# Altium project dvrk-s-pwm.PrjPCB (part 2 of 2)

## Sheet relay.SchDoc
size Letter; DocumentNumber: 5; SheetNumber: 5; SheetTotal: 6
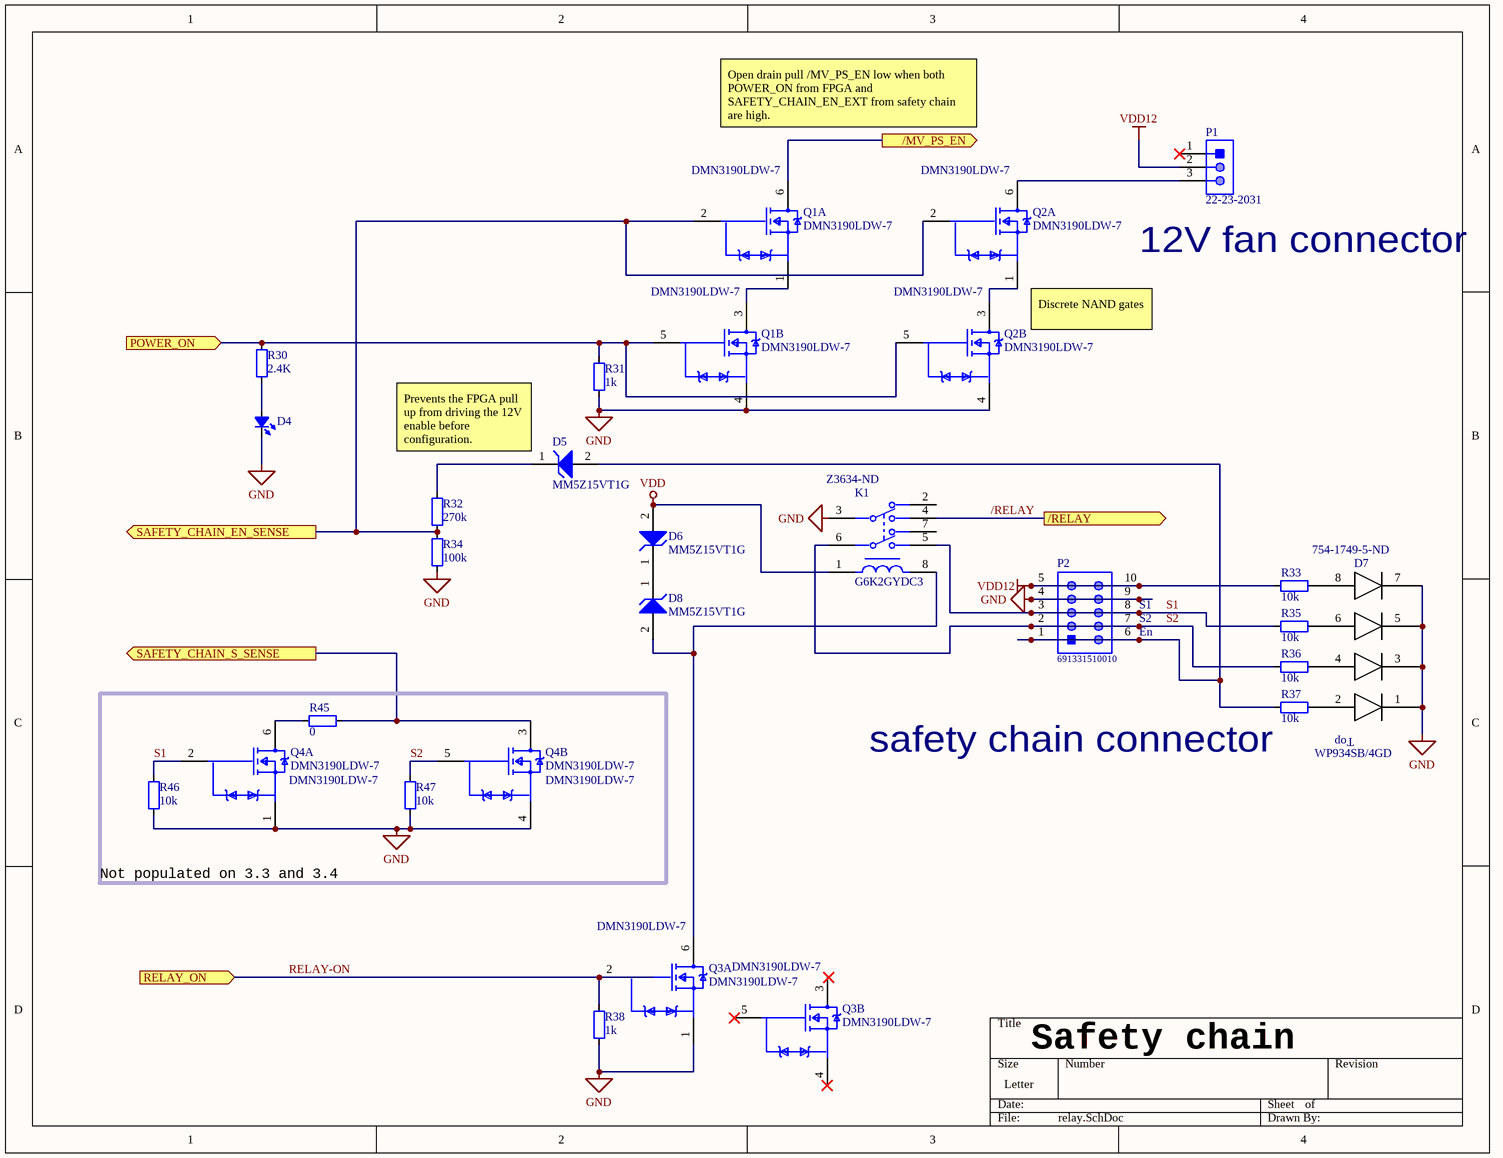
[diagram p4: relay.SchDoc]

### Parts
D4  LED_0402  [ROHM-SML-P11MT_V]  (value not drawn)
D5  MM5Z15VT1G  [ONSC-SOD-523-2-502-01_V]
D6  MM5Z15VT1G  [ONSC-SOD-523-2-502-01_V]
D7  WP934SB/4GD  Supplier Part Number 1: 754-1749-5-ND  [WP934SB/4GD]
D8  MM5Z15VT1G  [ONSC-SOD-523-2-502-01_V]
K1  G6K2GYDC3  Supplier Part Number 1: Z3634-ND  [FP-G6K2GYDC3-MFG]
P1  22-23-2031  [MOLX-22-23-2031_V]
P2  691331510010  [691331510010]
Q1  DMN3190LDW-7  [FP-SOT363-IPC_A]  (parts A,B of 2)
Q2  DMN3190LDW-7  [FP-SOT363-IPC_A]  (parts A,B of 2)
Q3  DMN3190LDW-7  [FP-SOT363-IPC_A]  (parts A,B of 2)
Q4  DMN3190LDW-7  [FP-SOT363-IPC_A]  (parts A,B of 2)
R30  value 2.4K  [FP-CRCW0402-e3-IPC_B]  (hidden comment: Res_0402)
R31  value 1k  [FP-CRCW0805-HPe3-IPC_B]  (hidden comment: Res_0805)
R32  value 270k  [FP-CRCW0402-e3-IPC_B]  (hidden comment: Res_0402)
R33  value 10k  [FP-CRCW0402-e3-IPC_B]  (hidden comment: Res_0402)
R34  value 100k  [FP-CRCW0402-e3-IPC_B]  (hidden comment: Res_0402)
R35  value 10k  [FP-CRCW0402-e3-IPC_B]  (hidden comment: Res_0402)
R36  value 10k  [FP-CRCW0402-e3-IPC_B]  (hidden comment: Res_0402)
R37  value 10k  [FP-CRCW0402-e3-IPC_B]  (hidden comment: Res_0402)
R38  value 1k  [FP-CRCW0805-HPe3-IPC_B]  (hidden comment: Res_0805)
R45  value 0  [FP-CRCW0402-e3-IPC_B]  (hidden comment: Res_0402)
R46  value 10k  [FP-CRCW0402-e3-IPC_B]  (hidden comment: Res_0402)
R47  value 10k  [FP-CRCW0402-e3-IPC_B]  (hidden comment: Res_0402)

### Blocks framed on the sheet
Not populated on 3.3 and 3.4: Q4 R45-R47

### Ports
/MV_PS_EN (out), /RELAY (out), POWER_ON (in), RELAY_ON (in), SAFETY_CHAIN_EN_SENSE (out), SAFETY_CHAIN_S_SENSE (out)

### Nets
GND: D4.2(K) D7.1 D7.3 D7.5 D7.7 K1.3 P2.4 P2.9 Q1.4(S2) Q2.4(S2) Q3.1(S1) Q4.1(S1) Q4.4(S2) R31.1 R34.1 R38.1 R46.1 R47.1
VDD: D6.2(A) K1.1
VDD12: P1.2 P2.5 P2.10 R33.2
/RELAY: K1.4 ; port /RELAY
MOTOR_POWER_EN: Q1.5(G2) Q2.5(G2) R30.2 R31.2 ; port POWER_ON
RELAY-ON: Q3.2(G1) R38.2 ; port RELAY_ON
S1: K1.5 P2.3 P2.8 Q4.2(G1) R35.2 R46.2
S2: K1.6 P2.2 P2.7 Q4.5(G2) R36.2 R47.2
SAFETY_CHAIN_EN_SENSE: Q1.2(G1) Q2.2(G1) R32.1 R34.2 ; port SAFETY_CHAIN_EN_SENSE
SAFETY_CHAIN_S_SENSE: Q4.3(D2) R45.2 ; port SAFETY_CHAIN_S_SENSE
NetD4_1: D4.1(A) R30.1
NetD5_1: D5.1(K) R32.2
NetD5_2: D5.2(A) P2.1 P2.6 R37.2
NetD6_1: D6.1(K) D8.1(K)
NetD7_2: D7.2 R37.1
NetD7_4: D7.4 R36.1
NetD7_6: D7.6 R35.1
NetD7_8: D7.8 R33.1
NetD8_2: D8.2(A) K1.8 Q3.6(D1)
NetJ2_1: Q1.6(D1) ; port /MV_PS_EN
NetP1_3: P1.3 Q2.6(D1)
NetQ1_1: Q1.1(S1) Q1.3(D2)
NetQ2_1: Q2.1(S1) Q2.3(D2)
NetQ4_6: Q4.6(D1) R45.1

Not connected (* = marked no-connect by the designer): K1 2 7; P1 1*; Q3 3(D2) 4(S2)* 5(G2)*

### Notes on the sheet
- Open drain pull /MV_PS_EN low when both POWER_ON from FPGA and SAFETY_CHAIN_EN_EXT from safety chain are high.
- (near P1) 12V fan connector
- (near Q2) Discrete NAND gates
- Prevents the FPGA pull up from driving the 12V enable before configuration.
- (near P2) S1
- (near P2) S2
- (near P2) En
- (near R37) safety chain connector
- Safety chain
- (in symbol WP934SB/4GD) Top

### Library data of the parts
D4 = LED_0402: LED ORANGE CLEAR CHIP SMD; Manufacturer: Kingbright; Manufacturer Part Number: APHHS1005SECK; Viewing Angle: 120°; Lens Style: Clear,Flat; Luminous Intensity: 240mcd; Forward Voltage: 2.1V; Forward Current: 20mA; Dominant Wavelength: 601nm; Number of LEDs: 1; Supplier 1: Digi-Key; Supplier Part Number 1: 754-1103-1-ND; RoHS: Yes; Category: LEDs; Stock 1: 25673; Pricing 1: 1=0.49000, 10=0.32500, 100=0.21700, 500=0.15010, 1000=0.12508 (USD); Mount: Surface Mount; Case/Package: 0402; Number of Pins: 2; Color: Orange; Case Code (Metric): 1005; Case Code (Imperial): 0402; Lens Color: Clear; Min Operating Temperature: -40°C; Max Operating Temperature: 85°C; Package Quantity: 2000; Packaging: Tape and Reel; Illumination Color: Orange; Test Current: 20mA; Wavelength: 601nm; Series: APHHS; Length: 1mm; Width: 0.5mm; Height: 0.6mm; Lead Free: Lead Free; RoHS Compliant: Yes; ComponentLink1URL: https://datasheet.ciiva.com/2114/aphhs1005seck-2114149.pdf?src-supplier=Digi-Key; ComponentLink1Description: https://datasheet.ciiva.com/2114/aphhs1005seck-2114149.pdf?src-supplier=Digi-Key; ComponentLink2URL: https://datasheet.ciiva.com/4688/aphhs1005seck-36485-4688716.pdf?src-supplier=Mouser; ComponentLink2Description: https://datasheet.ciiva.com/4688/aphhs1005seck-36485-4688716.pdf?src-supplier=Mouser; ComponentLink3URL: https://datasheet.ciiva.com/2114/aphhs1005seck-2114150.pdf?src-supplier=Digi-Key; ComponentLink3Description: https://datasheet.ciiva.com/2114/aphhs1005seck-2114150.pdf?src-supplier=Digi-Key; ComponentLink4URL: https://datasheet.ciiva.com/16412/aphhs1005seck-16412186.pdf?src-supplier=Future+Electronics; ComponentLink4Description: https://datasheet.ciiva.com/16412/aphhs1005seck-16412186.pdf?src-supplier=Future+Electronics; ComponentLink5URL: https://datasheet.ciiva.com/2114/aphhs1005seck-2114151.pdf?src-supplier=Digi-Key; ComponentLink5Description: https://datasheet.ciiva.com/2114/aphhs1005seck-2114151.pdf?src-supplier=Digi-Key
D5 D6 D8 = CMP-1060-00793-1: Zener Voltage Regulator, 500 mW, 2-Pin SOD-523, Pb-Free, Tape and Reel; Manufacturer: On Semiconductor; VZ Typ (V): 15; P Max (W): 0.5; PackageVersion: Rev. E, 09/2010; PartNumber: MM5Z15VT1G; ComponentLink2URL: http://www.onsemi.cn/pub_link/Collateral/MM5Z2V4T1-D.PDF; ComponentLink2Description: Datasheet; ComponentLink1Description: Manufacturer URL; PackageReference: SOD-523-2-502-01; ComponentLink3URL: http://www.onsemi.com/pub_link/Collateral/502-01.PDF; PackageDescription: 2-Pin SOD, Body 1.2 x 0.8 mm; ComponentLink3Description: Package Specification; RoHS: Pb-Free; ComponentLink1URL: http://www.onsemi.com/; Mounting Technology: Surface Mount; Packing: Tape and Reel; DatasheetVersion: Rev. 10
D7 = WP934SB/4GD: Triple Green T-1 3mm 40° Green Diffused 30 mcd 2.2 V LED Indicator Through Hole; Manufacturer: Kingbright; Lens Style: Diffused,Tinted; Voltage Rating: 2.2V; Forward Current: 20mA; Wavelength: 568nm; Luminous Intensity: 25mcd; Current: 25mA; Supplier 1: Digi-Key; Manufacturer Part Number: WP934SB/4GD; RoHS: Yes; Category: LEDs; Stock 1: 28787; Pricing 1: 1=1.91000, 10=1.20600, 100=0.89230, 500=0.81992, 1000=0.68250 (USD); Mount: Through Hole; Color: Green; Package Quantity: 600; Packaging: Bulk; Viewing Angle: 40°; Forward Voltage: 2.2V; Illumination Color: Green; Series: -; Lead Free: Lead Free; RoHS Compliant: Yes; ComponentLink1URL: https://datasheet.ciiva.com/26291/wp934sb-4gd-26291283.pdf?src-supplier=Digi-Key; ComponentLink1Description: https://datasheet.ciiva.com/26291/wp934sb-4gd-26291283.pdf?src-supplier=Digi-Key; ComponentLink2URL: https://datasheet.ciiva.com/12414/wp934sb-4gd-13439-12414341.pdf?src-supplier=Mouser; ComponentLink2Description: https://datasheet.ciiva.com/12414/wp934sb-4gd-13439-12414341.pdf?src-supplier=Mouser; ComponentLink3URL: https://datasheet.ciiva.com/2137/wp934sb-4gd-2137244.pdf?src-supplier=Digi-Key; ComponentLink3Description: https://datasheet.ciiva.com/2137/wp934sb-4gd-2137244.pdf?src-supplier=Digi-Key
K1 = CMP-08823-000034-1: RELAY TELECOM DPDT 1A 3VDC; Manufacturer: Omron; Manufacturer Part Number: G6K-2G-Y-DC3; Coil Resistance: 91R; Coil Type: Non-Latching; Max Voltage Rating (DC): 60V; Coil Voltage (DC): 3V; Release Time: 3ms; Coil Current: 33mA; Power Consumption: 100mW; Max Voltage Rating (AC): 125V; Min Operating Temperature: -40°C; Packaging: Rail/Tube; Series: G6K; Contact Material: Gold; Number of Pins: 8; Termination: Gull Wing; Lead Free: Lead Free; Throw Configuration: DPDT; Max Operating Temperature: 70°C; Relay Type: Telecom; Coil Power: 100mW; Contact Current Rating: 1A; Weight: 0.7g; Mount: Surface Mount; Max Current Rating: 1A; Package Quantity: 500; Radiation Hardening: No; Operate Time: 3ms; Supplier 1: Digi-Key; RoHS: Yes; Category: Signal Relays; Stock 1: 11994; Pricing 1: 1=4.45000, 10=4.16900, 25=3.70600, 40=3.52050, 80=3.33525, 230=2.96470, 500=2.77940, 1000=2.59411 (USD); ComponentLink1URL: https://datasheet.ciiva.com/30212/81en-g6k-30212142.pdf?src-supplier=Onlinecomponents.com; ComponentLink1Description: https://datasheet.ciiva.com/30212/81en-g6k-30212142.pdf?src-supplier=Onlinecomponents.com
P1 = CMP-2000-05242-1: Male Header, Pitch 2.54 mm, 1 x 3 Position, Height 8.18 mm, Tail Length 3.56 mm, RoHS, Bulk; Current Rating: 4A; Brand: Molex; Pitch: 2.54mm; Voltage Rating: 250V; Mounting Angle: Vertical; Type: Locking; Factory Pack Quantity: 16000; Tradename: KK; Housing Material: Nylon; Contact Material: Brass; Manufacturer URL: http://www.molex.com/; Termination Style: ThroughHole; Mounting Style: ThroughHole; Number of Positions: 3Position; Contact Gender: Pin(Male); Packaging: Bulk; Series: 6373; Datasheet Version: Sep-01; Contact Plating: Tin; Product: Headers; Datasheet URL: https://datasheet.ciiva.com/19472/232274-19472863.pdf; RoHS: Details; Product Category: Headers&WireHousings; Manufacturer: Molex; Number of Rows: 1Row
P2 = CMP-1502-02269-1: Serie 3315 - 5.08mm Double Level Horizontal Male PCB Header with Flanges WR-TBL, 10 pin; Manufacturer: Wurth Elektronik; Pin Number: 10; Datasheet URL: http://katalog.we-online.de/em/datasheet/6913315100xx.pdf; Part Number: 691331510010; Gender: Male; Manufacturer URL: http://www.we-online.de; Packaging: Box; Pitch: 5.08mm; Operating Temperature: -40to105degC; Publisher: WurthElektronik; Mounting Technology: THT; Package Reference: 691331510010
Q1-Q4 = CMP-12801-000100-1: MOSFET 2N-CH 30V 1A SOT363; Turn-Off Delay Time: 30.3ns; Turn-On Delay Time: 4.5ns; Number of Channels: 2; Max Power Dissipation: 320mW; Input Capacitance: 87pF; Rds On Max: 190mR; FET Type: 2 N-Channel; Gate to Source Voltage (Vgs): 20V; Rise Time: 8.9ns; Element Configuration: Dual; Fall Time: 15.6ns; Number of Pins: 6; Width: 1.35mm; Package Quantity: 3000; Drain to Source Voltage (Vdss): 30V; Length: 2.2mm; Case/Package: SOT-363; Weight: 0.000212oz; Min Operating Temperature: -55°C; Lead Free: Lead Free; Height: 1mm; Radiation Hardening: No; Drain to Source Resistance: 190mR; Continuous Drain Current (ID): 1A; Mount: Surface Mount; Packaging: Tape and Reel; Max Operating Temperature: 150°C; Supplier 1: Arrow Electronics; Supplier Part Number 1: DMN3190LDW-7
R30 R32-R37 R45-R47 = Res_0402: Resistor
R31 R38 = Res_0805: Resistor

## Sheet motor_channel_x2.SchDoc
size A3; DocumentNumber: 2; SheetNumber: 2; SheetTotal: 6
Used 5 times, as channels Ch1, Ch2, Ch3, Ch4, Ch5. Parts and nets are listed once, with the designators drawn on the sheet.
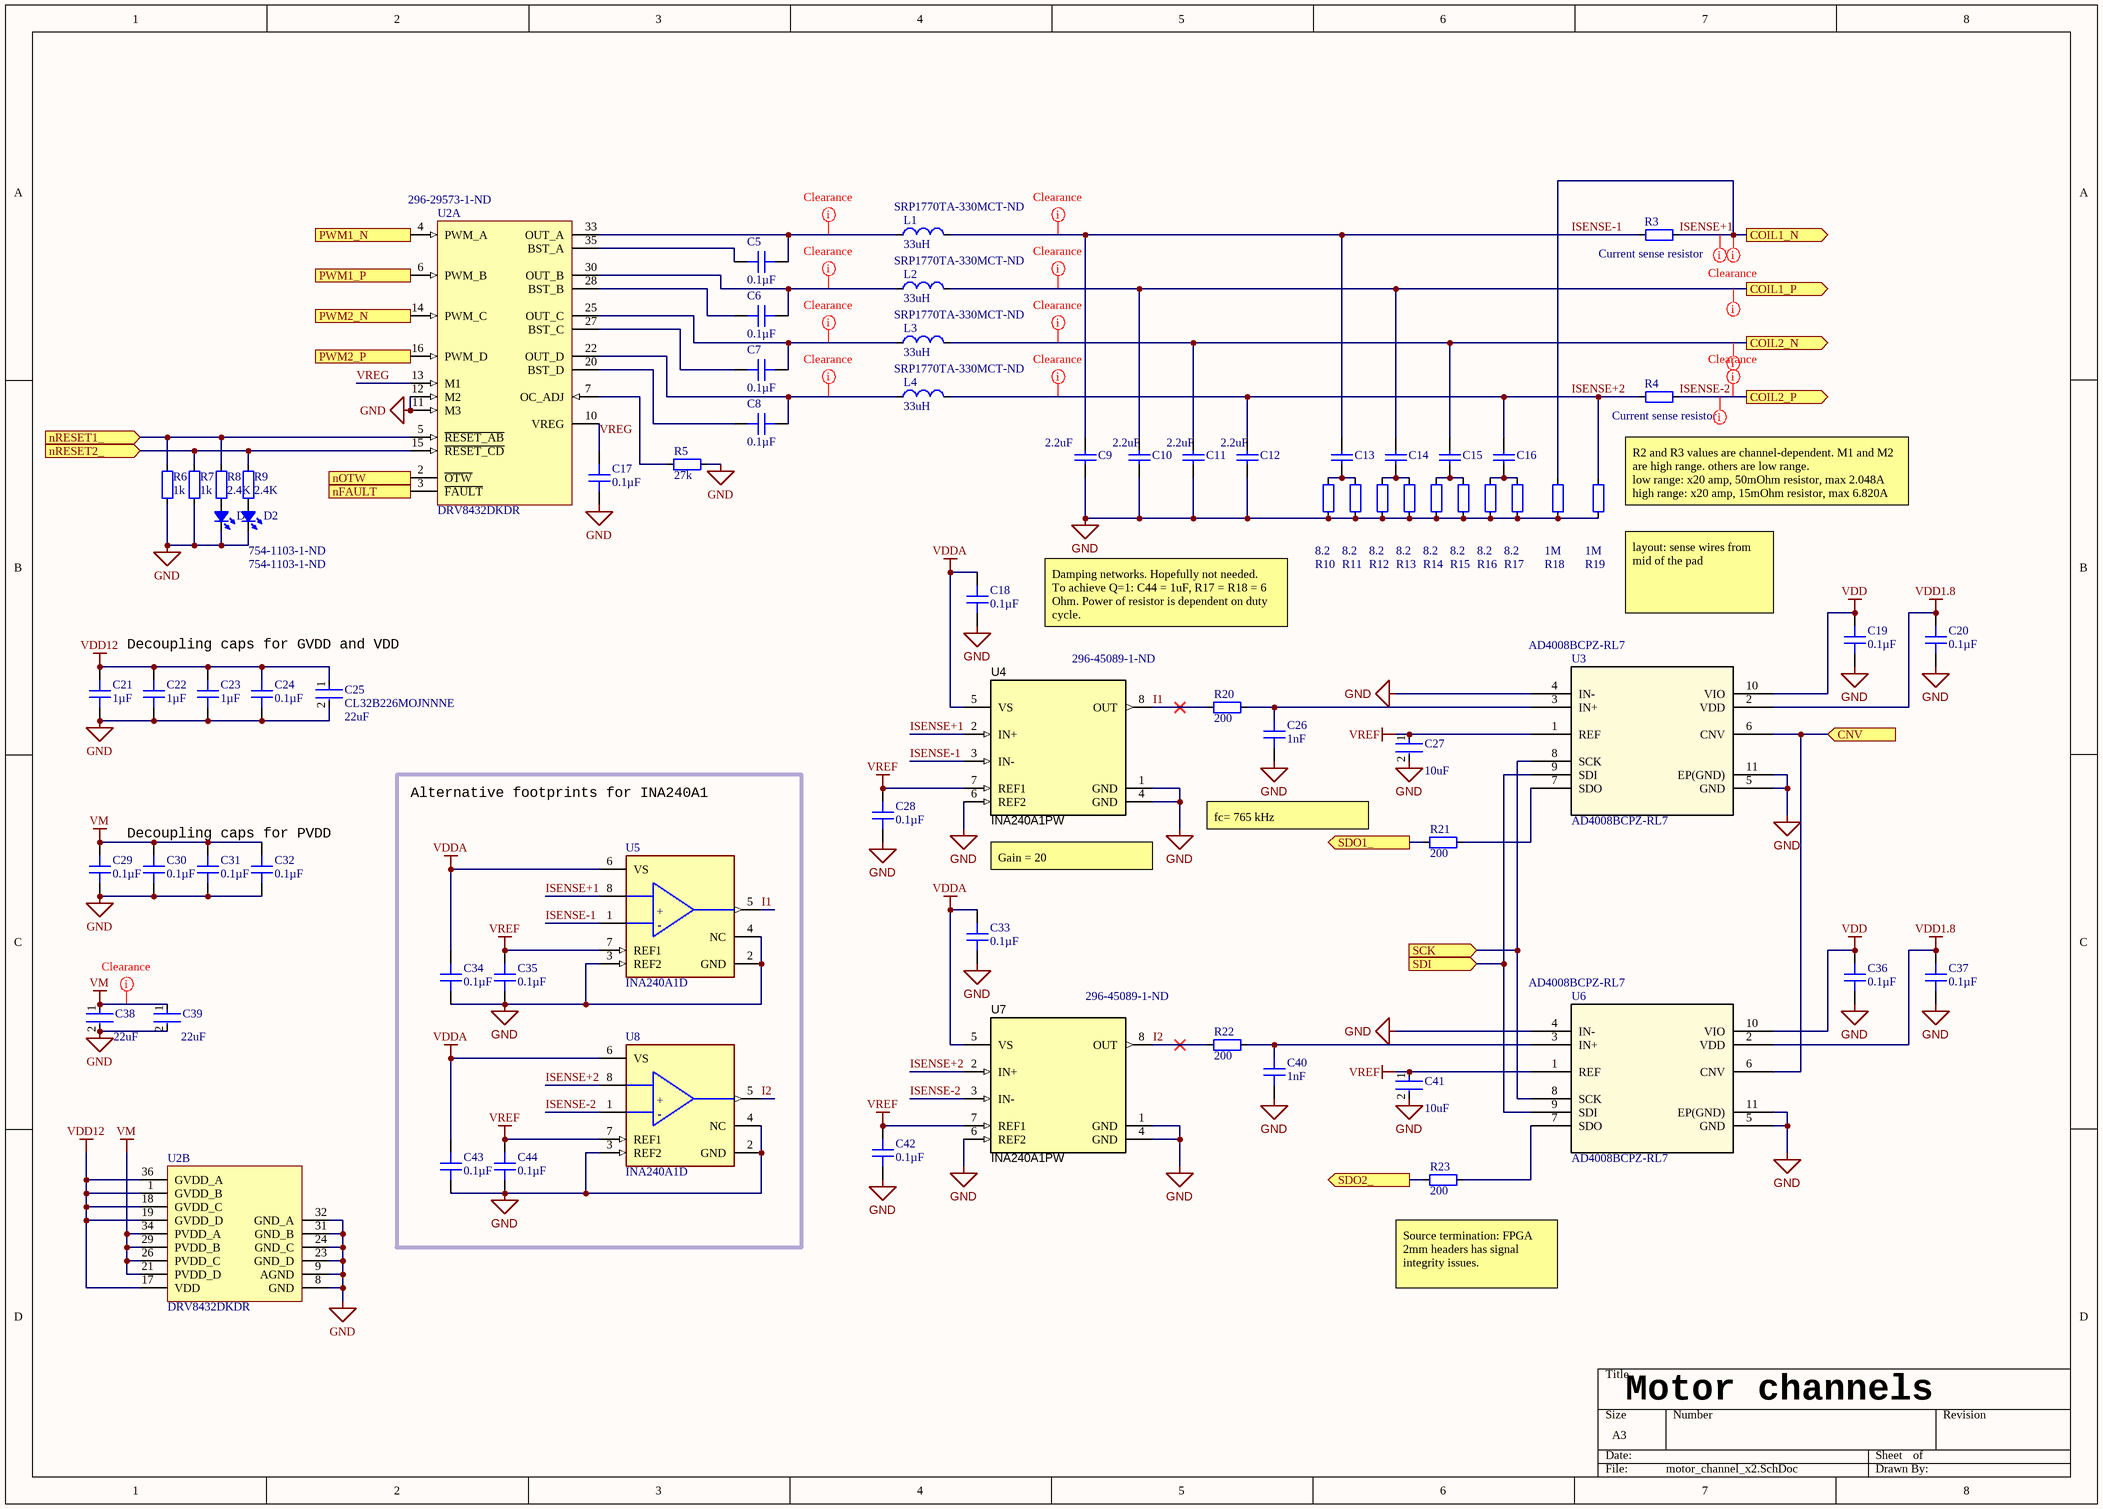
[diagram p5: motor_channel_x2.SchDoc]

### Parts
C5  0.1µF  [FP-GRM188-0_1-e0_2_0_55-IPC_B]
C6  0.1µF  [FP-GRM188-0_1-e0_2_0_55-IPC_B]
C7  0.1µF  [FP-GRM188-0_1-e0_2_0_55-IPC_B]
C8  0.1µF  [FP-GRM188-0_1-e0_2_0_55-IPC_B]
C9  Capacitance: 2.2uF  [CAPC3216X180X50NL20T25]  (hidden comment: 12061C225KAT2A)
C10  Capacitance: 2.2uF  [CAPC3216X180X50NL20T25]  (hidden comment: 12061C225KAT2A)
C11  Capacitance: 2.2uF  [CAPC3216X180X50NL20T25]  (hidden comment: 12061C225KAT2A)
C12  Capacitance: 2.2uF  [CAPC3216X180X50NL20T25]  (hidden comment: 12061C225KAT2A)
C13  12061C105KAT2A  [CAPC3216X180X50NL20T25]  (value not drawn)
C14  12061C105KAT2A  [CAPC3216X180X50NL20T25]  (value not drawn)
C15  12061C105KAT2A  [CAPC3216X180X50NL20T25]  (value not drawn)
C16  12061C105KAT2A  [CAPC3216X180X50NL20T25]  (value not drawn)
C17  0.1µF  [FP-GRM155-0_05-IPC_B]
C18  0.1µF  [FP-GRM155-0_05-IPC_B]
C19  0.1µF  [FP-GRM155-0_05-IPC_B]
C20  0.1µF  [FP-GRM155-0_05-IPC_B]
C21  1µF  [FP-GRM188-0_1-e0_2_0_55-IPC_B]
C22  1µF  [FP-GRM188-0_1-e0_2_0_55-IPC_B]
C23  1µF  [FP-GRM188-0_1-e0_2_0_55-IPC_B]
C24  0.1µF  [FP-GRM155-0_05-IPC_B]
C25  CL32B226MOJNNNE  Capacitance: 22uF  [FP-CL32-IPC_B]
C26  1nF  [FP-GRM155-0_05-IPC_B]
C27  Capacitance: 10uF  [FP-CL21-IPC_C]  (hidden comment: CL21B106KQQNNNG)
C28  0.1µF  [FP-GRM155-0_05-IPC_B]
C29  0.1µF  [FP-GRM188-0_1-e0_2_0_55-IPC_B]
C30  0.1µF  [FP-GRM188-0_1-e0_2_0_55-IPC_B]
C31  0.1µF  [FP-GRM188-0_1-e0_2_0_55-IPC_B]
C32  0.1µF  [FP-GRM188-0_1-e0_2_0_55-IPC_B]
C33  0.1µF  [FP-GRM155-0_05-IPC_B]
C34  0.1µF  [FP-GRM155-0_05-IPC_B]
C35  0.1µF  [FP-GRM155-0_05-IPC_B]
C36  0.1µF  [FP-GRM155-0_05-IPC_B]
C37  0.1µF  [FP-GRM155-0_05-IPC_B]
C38  Capacitance: 22uF  [FP-KRM55W-6_1_5_3_6_7_1_2-MFG]  (hidden comment: KRM55WR72A226MH01L)
C39  Capacitance: 22uF  [FP-KRM55W-6_1_5_3_6_7_1_2-MFG]  (hidden comment: KRM55WR72A226MH01L)
C40  1nF  [FP-GRM155-0_05-IPC_B]
C41  Capacitance: 10uF  [FP-CL21-IPC_C]  (hidden comment: CL21B106KQQNNNG)
C42  0.1µF  [FP-GRM155-0_05-IPC_B]
C43  0.1µF  [FP-GRM155-0_05-IPC_B]
C44  0.1µF  [FP-GRM155-0_05-IPC_B]
D1  Supplier Part Number 1: 754-1103-1-ND  [ROHM-SML-P11MT_V]  (hidden comment: LED_0402)
D2  Supplier Part Number 1: 754-1103-1-ND  [ROHM-SML-P11MT_V]  (hidden comment: LED_0402)
L1  value 33uH  Supplier Part Number 1: SRP1770TA-330MCT-ND  [SRP1770TA]
L2  value 33uH  Supplier Part Number 1: SRP1770TA-330MCT-ND  [SRP1770TA]
L3  value 33uH  Supplier Part Number 1: SRP1770TA-330MCT-ND  [SRP1770TA]
L4  value 33uH  Supplier Part Number 1: SRP1770TA-330MCT-ND  [SRP1770TA]
R3  Current sense resistor  [STACKPOLE CSR2512]
R4  Current sense resistor  [STACKPOLE CSR2512]
R5  value 27k  [FP-CRCW0402-e3-IPC_B]  (hidden comment: Res_0402)
R6  value 1k  [FP-CRCW0805-HPe3-IPC_B]  (hidden comment: Res_0805)
R7  value 1k  [FP-CRCW0805-HPe3-IPC_B]  (hidden comment: Res_0805)
R8  value 2.4K  [FP-CRCW0402-e3-IPC_B]  (hidden comment: Res_0402)
R9  value 2.4K  [FP-CRCW0402-e3-IPC_B]  (hidden comment: Res_0402)
R10  value 8.2  [RESC3216X70X50NL05T20]  (hidden comment: Res_0402)
R11  value 8.2  [RESC3216X70X50NL05T20]  (hidden comment: Res_0402)
R12  value 8.2  [RESC3216X70X50NL05T20]  (hidden comment: Res_0402)
R13  value 8.2  [RESC3216X70X50NL05T20]  (hidden comment: Res_0402)
R14  value 8.2  [RESC3216X70X50NL05T20]  (hidden comment: Res_0402)
R15  value 8.2  [RESC3216X70X50NL05T20]  (hidden comment: Res_0402)
R16  value 8.2  [RESC3216X70X50NL05T20]  (hidden comment: Res_0402)
R17  value 8.2  [RESC3216X70X50NL05T20]  (hidden comment: Res_0402)
R18  value 1M  [FP-CRCW0402-e3-IPC_B]  (hidden comment: Res_0402)
R19  value 1M  [FP-CRCW0402-e3-IPC_B]  (hidden comment: Res_0402)
R20  value 200  [FP-CRCW0402-e3-IPC_B]  (hidden comment: Res_0402)
R21  value 200  [FP-CRCW0402-e3-IPC_B]  (hidden comment: Res_0402)
R22  value 200  [FP-CRCW0402-e3-IPC_B]  (hidden comment: Res_0402)
R23  value 200  [FP-CRCW0402-e3-IPC_B]  (hidden comment: Res_0402)
U2  DRV8432DKDR  Supplier Part Number 1: 296-29573-1-ND  [DKD0036A_L_extra_clearance]  (parts A,B of 2)
U3  AD4008BCPZ-RL7  [CP_10_9]
U4  INA240A1PW  Supplier Part Number 1: 296-45089-1-ND  [PW0008A_N]
U5  INA240A1D  [FP-D0008A-IPC_C]
U6  AD4008BCPZ-RL7  [CP_10_9]
U7  INA240A1PW  Supplier Part Number 1: 296-45089-1-ND  [PW0008A_N]
U8  INA240A1D  [FP-D0008A-IPC_C]

### Blocks framed on the sheet
Alternative footprints for INA240A1: C34 C35 C43 C44 U5 U8

### Ports
CNV (in), COIL1_N (out), COIL1_P (out), COIL2_N (out), COIL2_P (out), nFAULT (out), nOTW (out), nRESET1_ (in), nRESET2_ (in), PWM1_N (in), PWM1_P (in), PWM2_N (in), PWM2_P (in), SCK (in), SDI (in), SDO1_ (out), SDO2_ (out)

### Nets
GND: C9.1 C10.1 C11.1 C12.1 C17.2 C18.2 C19.2 C20.2 C21.2 C22.2 C23.2 C24.2 C25.2 C26.2 C27.2 C28.2 C29.2 C30.2 C31.2 C32.2 C33.2 C34.2 C35.2 C36.2 C37.2 C38.2 C39.2 C40.2 C41.2 C42.2 C43.2 C44.2 D1.2(K) D2.2(K) R5.2 R6.1 R7.1 R10.1 R11.1 R12.1 R13.1 R14.1 R15.1 R16.1 R17.1 R18.1 R19.1 U2.8(GND) U2.9(AGND) U2.11(M3) U2.12(M2) U2.23(GND_D) U2.24(GND_C) U2.31(GND_B) U2.32(GND_A) U3.4(IN-) U3.5(GND) U3.11(EP(GND)) U4.1(GND) U4.4(GND) U4.6(REF2) U5.2(GND) U5.3(REF2) U5.4(NC) U6.4(IN-) U6.5(GND) U6.11(EP(GND)) U7.1(GND) U7.4(GND) U7.6(REF2) U8.2(GND) U8.3(REF2) U8.4(NC)
VDD: C19.1 C36.1 U3.10(VIO) U6.10(VIO)
VDD1.8: C20.1 C37.1 U3.2(VDD) U6.2(VDD)
VDD12: C21.1 C22.1 C23.1 C24.1 C25.1 U2.1(GVDD_B) U2.17(VDD) U2.18(GVDD_C) U2.19(GVDD_D) U2.36(GVDD_A)
VDDA: C18.1 C33.1 C34.1 C43.1 U4.5(VS) U5.6(VS) U7.5(VS) U8.6(VS)
VM: C29.1 C30.1 C31.1 C32.1 C38.1 C39.1 U2.21(PVDD_D) U2.26(PVDD_C) U2.29(PVDD_B) U2.34(PVDD_A)
VREF: C27.1 C28.1 C35.1 C41.1 C42.1 C44.1 U3.1(REF) U4.7(REF1) U5.7(REF1) U6.1(REF) U7.7(REF1) U8.7(REF1)
CNV: U3.6(CNV) U6.6(CNV) ; port CNV
COIL1_P: C10.2 C14.1 L2.2 ; port COIL1_P
COIL2_N: C11.2 C15.1 L3.2 ; port COIL2_N
I1: R20.1 U4.8(OUT) U5.5(OUT)
I2: R22.1 U7.8(OUT) U8.5(OUT)
ISENSE+1: R3.2 R18.2 U4.2(IN+) U5.8(IN+) ; port COIL1_N
ISENSE+2: C12.2 C16.1 L4.2 R4.1 R19.2 U7.2(IN+) U8.8(IN+)
ISENSE-1: C9.2 C13.1 L1.2 R3.1 U4.3(IN-) U5.1(IN-)
ISENSE-2: R4.2 U7.3(IN-) U8.1(IN-) ; port COIL2_P
nFAULT: U2.3(~{FAULT}) ; port nFAULT
nOTW: U2.2(~{OTW}) ; port nOTW
nRESET1_: R6.2 R8.2 U2.5(~{RESET_AB}) ; port nRESET1_
nRESET2_: R7.2 R9.2 U2.15(~{RESET_CD}) ; port nRESET2_
PWM1_N: U2.4(PWM_A) ; port PWM1_N
PWM1_P: U2.6(PWM_B) ; port PWM1_P
PWM2_N: U2.14(PWM_C) ; port PWM2_N
PWM2_P: U2.16(PWM_D) ; port PWM2_P
SCK: U3.8(SCK) U6.8(SCK) ; port SCK
SDI: U3.9(SDI) U6.9(SDI) ; port SDI
SDO1_: R21.1 ; port SDO1_
SDO2_: R23.1 ; port SDO2_
VREG: C17.1 U2.10(VREG) U2.13(M1)
NetC5_1: C5.1 U2.35(BST_A)
NetC5_2: C5.2 L1.1 U2.33(OUT_A)
NetC6_1: C6.1 U2.28(BST_B)
NetC6_2: C6.2 L2.1 U2.30(OUT_B)
NetC7_1: C7.1 U2.27(BST_C)
NetC7_2: C7.2 L3.1 U2.25(OUT_C)
NetC8_1: C8.1 U2.20(BST_D)
NetC8_2: C8.2 L4.1 U2.22(OUT_D)
NetC13_2: C13.2 R10.2 R11.2
NetC14_2: C14.2 R12.2 R13.2
NetC15_2: C15.2 R14.2 R15.2
NetC16_2: C16.2 R16.2 R17.2
NetC26_1: C26.1 R20.2 U3.3(IN+)
NetC40_1: C40.1 R22.2 U6.3(IN+)
NetD1_1: D1.1(A) R8.1
NetD2_1: D2.1(A) R9.1
NetR5_1: R5.1 U2.7(OC_ADJ)
NetR21_2: R21.2 U3.7(SDO)
NetR23_2: R23.2 U6.7(SDO)

### Channels
Ch1: designators end in _Ch1; ports CNV=ADC_CNV COIL1_N=BRAKE2 COIL1_P=/BRAKE2 COIL2_N=BRAKE1 COIL2_P=/BRAKE1 nFAULT=nFAULT1 nOTW=nOTW1 nRESET1_=nRESET1_1 nRESET2_=nRESET2_1 PWM1_N=PWM1_N1 PWM1_P=PWM1_P1 PWM2_N=PWM2_N1 PWM2_P=PWM2_P1 SCK=ADC_SCK SDI=ADC_SDI SDO1_=ADC_CUR_SDO1_1 SDO2_=ADC_CUR_SDO2_1
Ch2: designators end in _Ch2; ports CNV=ADC_CNV COIL1_N=COIL1_N2 COIL1_P=/MOTOR1 COIL2_N=BRAKE3 COIL2_P=/BRAKE3 nFAULT=nFAULT2 nOTW=nOTW2 nRESET1_=nRESET1_2 nRESET2_=nRESET2_2 PWM1_N=PWM1_N2 PWM1_P=PWM1_P2 PWM2_N=PWM2_N2 PWM2_P=PWM2_P2 SCK=ADC_SCK SDI=ADC_SDI SDO1_=ADC_CUR_SDO1_2 SDO2_=ADC_CUR_SDO2_2
Ch3: designators end in _Ch3; ports CNV=ADC_CNV COIL1_N=COIL1_N3 COIL1_P=/MOTOR2 COIL2_N=COIL2_N3 COIL2_P=/MOTOR5 nFAULT=nFAULT3 nOTW=nOTW3 nRESET1_=nRESET1_3 nRESET2_=nRESET2_3 PWM1_N=PWM1_N3 PWM1_P=PWM1_P3 PWM2_N=PWM2_N3 PWM2_P=PWM2_P3 SCK=ADC_SCK SDI=ADC_SDI SDO1_=ADC_CUR_SDO1_3 SDO2_=ADC_CUR_SDO2_3
Ch4: designators end in _Ch4; ports CNV=ADC_CNV COIL1_N=COIL1_N4 COIL1_P=/MOTOR3 COIL2_N=COIL2_N4 COIL2_P=/MOTOR6 nFAULT=nFAULT4 nOTW=nOTW4 nRESET1_=nRESET1_4 nRESET2_=nRESET2_4 PWM1_N=PWM1_N4 PWM1_P=PWM1_P4 PWM2_N=PWM2_N4 PWM2_P=PWM2_P4 SCK=ADC_SCK SDI=ADC_SDI SDO1_=ADC_CUR_SDO1_4 SDO2_=ADC_CUR_SDO2_4
Ch5: designators end in _Ch5; ports CNV=ADC_CNV COIL1_N=COIL1_N5 COIL1_P=/MOTOR4 COIL2_N=COIL2_N5 COIL2_P=/MOTOR7 nFAULT=nFAULT5 nOTW=nOTW5 nRESET1_=nRESET1_5 nRESET2_=nRESET2_5 PWM1_N=PWM1_N5 PWM1_P=PWM1_P5 PWM2_N=PWM2_N5 PWM2_P=PWM2_P5 SCK=ADC_SCK SDI=ADC_SDI SDO1_=ADC_CUR_SDO1_5 SDO2_=ADC_CUR_SDO2_5

### Layout directives
net class hv: /BRAKE1, /BRAKE2, BRAKE1, BRAKE2, ISENSE+2_Ch1, ISENSE-1_Ch1, NetC5_Ch1_2, NetC6_Ch1_2, NetC7_Ch1_2, NetC8_Ch1_2, VM
net class no-copy-routing: /BRAKE1, /BRAKE2, BRAKE1, BRAKE2

### Notes on the sheet
- R2 and R3 values are channel-dependent. M1 and M2 are high range. others are low range.
  low range: x20 amp, 50mOhm resistor, max 2.048A
  high range: x20 amp, 15mOhm resistor, max 6.820A
- Decoupling caps for GVDD and VDD
- Damping networks. Hopefully not needed.
  To achieve Q=1: C44 = 1uF, R17 = R18 = 6 Ohm. Power of resistor is dependent on duty cycle.
- (near R19) layout: sense wires from mid of the pad
- Decoupling caps for PVDD
- fc= 765 kHz
- Gain = 20
- (near R23) Source termination: FPGA 2mm headers has signal integrity issues.
- Motor channels
- (in symbol CMP-04895-000409-1) +; -

### Library data of the parts
C5-C8 C29-C32 = 06031C104KAT2A: CAP CER 0.1UF 100V X7R 0603; Manufacturer: AVX Corporation; Tolerance: ±10%; Part Number: 06031C104KAT2A; Value: 0.1µF; Applications: General Purpose; Capacitance: 0.1µF; ComponentLink1Description: Datasheet; ComponentLink1URL: http://datasheets.avx.com/X7RDielectric.pdf; ComponentLink2Description: DigiKey Link; ComponentLink2URL: http://digikey.com/product-detail/en/avx-corporation/06031C104KAT2A/478-10047-1-ND/6564270; Device Package: 0603 (1608 Metric); LastUpdated: 9/2/2020 1:03:14 AM; Lifecycle Status: Active; Minimum Order: 1; Mounting Type: Surface Mount, MLCC; Operating Temperature: -55°C ~ 125°C; Package / Case: 0603 (1608 Metric); Packaging: TapeAndReel; PartId: 14077; Part Status: Active; Price: 0.03; Series: -; Size / Dimension: 0.063" L x 0.032" W (1.60mm x 0.81mm); Supplier 1: DigiKey; Supplier Part Number 1: 478-10047-1-ND; Temperature Coefficient: X7R; Thickness (Max): 0.037" (0.94mm); Voltage - Rated: 100V
C9-C12 = CMP-2000-07542-1: Chip Capacitor, 2.2 uF, +/- 10%, 100 V, -55 to 125 degC, 1206 (3216 Metric), RoHS, Tape and Reel; Manufacturer: AVX; Case\/Package: 1206; Voltage: 100V; Dielectric: X7R; Thickness: 0.037inch; Case Code (Metric): 3216; Mounting Technology: SurfaceMount; Tolerance: 10%; Package Quantity: 2500; Mount: SurfaceMount; REACH SVHC: NoSVHC; Case Code (Imperial): 1206; Datasheet URL: http://datasheets.avx.com/X7RDielectric.pdf; Voltage Rating: 100V; Package Reference: 1206; Termination: SMD/SMT; Max Operating Temperature: 125degC; Depth: 1.6mm; Voltage Rating (DC): 100V; Width: 0.063inch; Min Operating Temperature: -55degC; RoHSCompliant: true; Packaging: TapeandReel; Package Description: 2-Pin Surface Mount Device, Body 3.2 x 1.6 mm; Datasheet Version: 03/2017; Manufacturer URL: http://www.avx.com/; Lead Free: LeadFree; Length: 3.2mm
C13-C16 = CMP-1037-04728-2: Chip Capacitor, 1 uF, +/- 10%, 100 V, -55 to 125 degC, 1206 (3216 Metric), RoHS, Tape and Reel; Manufacturer: AVX; Capacitance: 1µF; Dielectric: X7R; Rated Voltage: 100V; Mounting Technology: SurfaceMount; Package Description: 2-Pin Surface Mount Device, Body 3.2 x 1.6 mm; Case Size/Dimension: 1206; Datasheet Version: 07/2016; Manufacturer URL: http://www.avx.com/; Package Reference: 1206; Datasheet URL: http://datasheets.avx.com/X7RDielectric.pdf; Tolerance (%): ±10%
C17-C20 C24 C28 C33-C37 C42-C44 = 04023C104KAT2A: CAP CER 0.1UF 25V X7R 0402; Manufacturer: AVX Corporation; Tolerance: ±10%; Value: 0.1µF; Part Number: 04023C104KAT2A; Applications: General Purpose; Capacitance: 0.1µF; ComponentLink1Description: Datasheet; ComponentLink1URL: http://datasheets.avx.com/X7RDielectric.pdf; ComponentLink2Description: DigiKey Link; ComponentLink2URL: http://digikey.com/product-detail/en/avx-corporation/04023C104KAT2A/478-7868-1-ND/3881491; Device Package: 0402 (1005 Metric); LastUpdated: 9/2/2020 1:02:21 AM; Lifecycle Status: Active; Minimum Order: 1; Mounting Type: Surface Mount, MLCC; Operating Temperature: -55°C ~ 125°C; Package / Case: 0402 (1005 Metric); Packaging: CutTape; PartId: 3190; Part Status: Active; Price: 0.13; Series: -; Size / Dimension: 0.039" L x 0.020" W (1.00mm x 0.50mm); Supplier 1: DigiKey; Supplier Part Number 1: 478-7868-1-ND; Temperature Coefficient: X7R; Thickness (Max): 0.022" (0.55mm); Voltage - Rated: 25V
C21-C23 = TMK107B7105KA-T: CAP CER 1UF 25V X7R 0603; Manufacturer: Taiyo Yuden; Tolerance: ±10%; Part Number: TMK107B7105KA-T; Value: 1µF; Applications: General Purpose; Capacitance: 1µF; ComponentLink1Description: Datasheet; ComponentLink1URL: https://www.yuden.co.jp/productdata/catalog/mlcc01_e.pdf; ComponentLink2Description: DigiKey Link; ComponentLink2URL: http://digikey.com/product-detail/en/taiyo-yuden/TMK107B7105KA-T/587-2984-1-ND/2714177; Device Package: 0603 (1608 Metric); LastUpdated: 9/2/2020 1:03:30 AM; Lifecycle Status: Active; Minimum Order: 1; Mounting Type: Surface Mount, MLCC; Operating Temperature: -55°C ~ 125°C; Package / Case: 0603 (1608 Metric); Packaging: TapeAndReel; PartId: 5586; Part Status: Active; Price: 0.01; Series: M; Size / Dimension: 0.063" L x 0.031" W (1.60mm x 0.80mm); Supplier 1: DigiKey; Supplier Part Number 1: 587-2984-1-ND; Temperature Coefficient: X7R; Thickness (Max): 0.035" (0.90mm); Voltage - Rated: 25V
C25 = CMP-13271-003818-1: Cap Ceramic 22uF 16V X7R ±20% SMD 1210 +125°C Embossed T/R; Mount: Surface Mount; Case/Package: 1210; Case Code (Imperial): 1210; Depth: 2.5mm; Packaging: Tape and Reel; Case Code (Metric): 3225; Package Quantity: 1; Min Operating Temperature: -55°C; Dielectric: X7R; Height: 2.5mm; Length: 3.2mm; Max Operating Temperature: 125°C; Thickness: 0.106inch; Width: 0.098inch; Tolerance: 20%; Voltage Rating: 16V; Radiation Hardening: No
C26 C40 = 04023C102KAT2A: CAP CER 1000PF 25V X7R 0402; Manufacturer: AVX Corporation; Tolerance: ±10%; Value: 1nF; ComponentLink1Description: Datasheet; ComponentLink1URL: http://datasheets.avx.com/X7RDielectric.pdf; Part Number: 04023C102KAT2A; Applications: General Purpose; Capacitance: 1000pF; ComponentLink2Description: DigiKey Link; ComponentLink2URL: http://digikey.com/product-detail/en/avx-corporation/04023C102KAT2A/478-6193-1-ND/2391392; Device Package: 0402 (1005 Metric); LastUpdated: 2020-09-02 01:02:20.597000; Lifecycle Status: Active; Minimum Order: 1; Mounting Type: Surface Mount, MLCC; Operating Temperature: -55°C ~ 125°C; Package / Case: 0402 (1005 Metric); Packaging: TapeAndReel; PartId: 3384; Part Status: Active; Price: 0.01; Series: -; Size / Dimension: 0.039 L x 0.020 W (1.00mm x 0.50mm); Temperature Coefficient: X7R; Thickness (Max): 0.022 (0.56mm); Voltage - Rated: 25V; Supplier 1: DigiKey; Supplier Part Number 1: 478-6193-1-ND
C27 C41 = CMP-13271-001427-1: CL21 Series 0805 10uF 6.3V ±10% Tolerance X7R Multilayer Ceramic Chip Capacitor; Min Operating Temperature: -55°C; Dielectric: X7R; Voltage Rating: 6.3V; Case/Package: 0805; Height: 1.25mm; Case Code (Metric): 2012; Tolerance: 10%; Packaging: Tape and Reel; Thickness: 0.055inch; Voltage: 6.3V; Max Operating Temperature: 125°C; Lead Free: Lead Free; Package Quantity: 3000; Case Code (Imperial): 0805; Depth: 1.25mm; Width: 0.049inch; Length: 2mm; Mount: Surface Mount
C38 C39 = CMP-06035-003571-1: CAP CER 22UF 100V X7R SMD; Tolerance: 20%; Lead/Base Style: J-Lead; Packaging: Cut Tape; Mount: Surface Mount; Min Operating Temperature: -55°C; Max Operating Temperature: 125°C; Case/Package: SMD/SMT; Voltage Rating: 100V; Supplier 1: Arrow Electronics; Supplier Part Number 1: KRM55WR72A226MH01L
D1 D2 = LED_0402: as D4 on sheet relay; Supplier 1: Digi-Key; RoHS: Yes; Category: LEDs; Stock 1: 25673; Pricing 1: 1=0.49000, 10=0.32500, 100=0.21700, 500=0.15010, 1000=0.12508 (USD); Mount: Surface Mount; Case/Package: 0402; Number of Pins: 2; Color: Orange; Case Code (Metric): 1005; Case Code (Imperial): 0402; Lens Color: Clear; Min Operating Temperature: -40°C; Max Operating Temperature: 85°C; Package Quantity: 2000; Packaging: Tape and Reel; Illumination Color: Orange; Test Current: 20mA; Wavelength: 601nm; Series: APHHS; Length: 1mm; Width: 0.5mm; Height: 0.6mm; Lead Free: Lead Free; RoHS Compliant: Yes; ComponentLink1URL: https://datasheet.ciiva.com/2114/aphhs1005seck-2114149.pdf?src-supplier=Digi-Key; ComponentLink1Description: https://datasheet.ciiva.com/2114/aphhs1005seck-2114149.pdf?src-supplier=Digi-Key; ComponentLink2URL: https://datasheet.ciiva.com/4688/aphhs1005seck-36485-4688716.pdf?src-supplier=Mouser; ComponentLink2Description: https://datasheet.ciiva.com/4688/aphhs1005seck-36485-4688716.pdf?src-supplier=Mouser; ComponentLink3URL: https://datasheet.ciiva.com/2114/aphhs1005seck-2114150.pdf?src-supplier=Digi-Key; ComponentLink3Description: https://datasheet.ciiva.com/2114/aphhs1005seck-2114150.pdf?src-supplier=Digi-Key; ComponentLink4URL: https://datasheet.ciiva.com/16412/aphhs1005seck-16412186.pdf?src-supplier=Future+Electronics; ComponentLink4Description: https://datasheet.ciiva.com/16412/aphhs1005seck-16412186.pdf?src-supplier=Future+Electronics; ComponentLink5URL: https://datasheet.ciiva.com/2114/aphhs1005seck-2114151.pdf?src-supplier=Digi-Key; ComponentLink5Description: https://datasheet.ciiva.com/2114/aphhs1005seck-2114151.pdf?src-supplier=Digi-Key
L1-L4 = Ind_0805: Inductor Power Shielded Wirewound 33uH 20% 100KHz 20Q-Factor Carbonyl Powder 10.7A 0.044Ohm DCR Automotive T/R; Manufacturer: TDK; Manufacturer Part Number: MPZ2012S300AT000; Core Material: Ferrite; Impedance: 30R; Current Rating: 6A; DC Resistance (DCR): 10mR; Inductance: 100uH; Saturation Current: 6.5A; Self Resonant Frequency: 2MHz; RMS Current (Irms): 5.3A; Stock 1: 117704; Pricing 1: 1=0.11, 10=0.091, 25=0.0704, 50=0.0584, 100=0.0503, 250=0.04028, 500=0.03624, 1000=0.0302 (USD); Mount: Surface Mount; Case/Package: 0805; Number of Pins: 3; Case Code (Metric): 2012; Case Code (Imperial): 0805; Packaging: Tape and Reel; Package Quantity: 1; Max DC Current: 6A; Length: 0.079inch; Height: 0.041inch; Width: 0.049inch; Depth: 1.25mm; REACH SVHC: No SVHC; Lead Free: Lead Free; ComponentLink1URL: https://datasheet.ciiva.com/46381/1750041-46381644.pdf; ComponentLink1Description: https://datasheet.ciiva.com/46381/1750041-46381644.pdf; ComponentLink2URL: https://datasheet.ciiva.com/48682/beads-commercial-power-mpz-en-48682508.pdf; ComponentLink2Description: https://datasheet.ciiva.com/48682/beads-commercial-power-mpz-en-48682508.pdf; ComponentLink3URL: https://datasheet.ciiva.com/8077/55169-8077085.pdf; ComponentLink3Description: https://datasheet.ciiva.com/8077/55169-8077085.pdf; ComponentLink4URL: https://datasheet.ciiva.com/8077/55169-8077086.pdf; ComponentLink4Description: https://datasheet.ciiva.com/8077/55169-8077086.pdf; ComponentLink5URL: https://datasheet.ciiva.com/46634/beads-commercial-power-mpz-en-46634590.pdf; ComponentLink5Description: https://datasheet.ciiva.com/46634/beads-commercial-power-mpz-en-46634590.pdf; ComponentLink6URL: https://datasheet.ciiva.com/46634/beads-commercial-power-mpz-en-46634367.pdf; ComponentLink6Description: https://datasheet.ciiva.com/46634/beads-commercial-power-mpz-en-46634367.pdf; RoHS: Yes; Category: Fixed Inductors; Stock 2: 10; Pricing 2: 1=4.75000, 10=4.35200, 25=3.95640, 50=3.32340, 100=2.84860 (USD); Min Operating Temperature: -40°C; Max Operating Temperature: 150°C; Resistor Type: Wirewound; Shielding: Shielded; Test Frequency: 100kHz; Tolerance: 20%; Inductance Tolerance: 20%; Height - Seated (Max): 0.276inch; Ratings: AEC-Q200; RoHS Compliant: Yes; ComponentLink7URL: http://www.farnell.com/datasheets/2360566.pdf?src-supplier=Farnell; ComponentLink7Description: http://www.farnell.com/datasheets/2360566.pdf?src-supplier=Farnell; ComponentLink8URL: http://www.farnell.com/datasheets/1955470.pdf?src-supplier=Element14; ComponentLink8Description: http://www.farnell.com/datasheets/1955470.pdf?src-supplier=Element14; ComponentLink9URL: http://www.bourns.com/docs/Product-Datasheets/SRP1770TA.pdf?src-supplier=Digi-Key; ComponentLink9Description: http://www.bourns.com/docs/Product-Datasheets/SRP1770TA.pdf?src-supplier=Digi-Key; ComponentLink10URL: https://www.bourns.com/docs/Product-Datasheets/SRP1770TA.pdf?src-supplier=Digi-Key; ComponentLink10Description: https://www.bourns.com/docs/Product-Datasheets/SRP1770TA.pdf?src-supplier=Digi-Key; ComponentLink11URL: http://www.farnell.com/datasheets/1955470.pdf?src-supplier=Farnell; ComponentLink11Description: http://www.farnell.com/datasheets/1955470.pdf?src-supplier=Farnell; Supplier 1: Digi-Key
R3 R4 = Res_0402_3: RES 2512
R5 R8-R23 = Res_0402: Resistor
R6 R7 = Res_0805: Resistor
U2 = CMP-1556-00009-2: 12 A Dual Brushed DC or Single Bipolar Stepper Motor Driver (PWM Ctrl), 0 to 52.5 V, -40 to 85 degC, 36-pin SOP (DKD36), Green (RoHS & no Sb/Br); Manufacturer: Texas Instruments; Vs(Min)(V): 0; rDS (ON) (LS + HS)(mOhms): 220; RMS Output Current(A): 7; Vs(Max)(V): 52.5; Peak Output Current(A): 12; Operating Supply Voltage: 50V; Output Current: 7A; Max Supply Voltage: 52.5V; Min Supply Voltage: 0V; Number of Outputs: 2; Nominal Supply Current: 10.5mA; Power Dissipation: 5W; Max Output Current: 12A; Fault Protection: Over Temperature,Short Circuit; DatasheetVersion: SLES242D; ComponentLink1URL: http://www.ti.com/; ComponentLink1Description: Manufacturer URL; PackageVersion: 4204421-2/K, 11/2013; ComponentLink3Description: Package Specification; Package Reference: DKD0036A; ComponentLink2Description: Datasheet; PackageDescription: 36-Pin Plastic Small Outline, Body 15.9 x 11 mm, Pitch 0.65 mm; Control I/F: PWM; Eco-Plan: Green (RoHS & no Sb/Br); Mounting Technology: Surface Mount; ComponentLink2URL: http://www.ti.com/general/docs/lit/getliterature.tsp?genericPartNumber=DRV8432&fileType=pdf; PartNumber: DRV8432DKDR; ComponentLink3URL: http://www.ti.com/lit/ml/mpds126j/mpds126j.pdf; Supplier 1: Digi-Key; Manufacturer Part Number: DRV8432DKDR; RoHS: Yes; Category: Amplifiers - Audio; Stock 1: 927; Pricing 1: 1=12.21000, 10=11.03000, 25=10.51720, 100=8.72170, 250=7.95212 (USD); Mount: Surface Mount; Case/Package: HSSOP; Number of Pins: 36; Min Operating Temperature: -40°C; Max Operating Temperature: 85°C; Package Quantity: 500; Packaging: Tape and Reel; Supply Current: 10.5mA; Series: DRV8432; Interface: PWM; Output Current per Channel: 7A; Radiation Hardening: No; Lead Free: Lead Free; RoHS Compliant: Yes; ComponentLink4URL: https://datasheet.ciiva.com/15109/getdatasheetpartid-482142-15109561.pdf?src-supplier=Verical; ComponentLink4Description: https://datasheet.ciiva.com/15109/getdatasheetpartid-482142-15109561.pdf?src-supplier=Verical; ComponentLink5URL: https://datasheet.ciiva.com/1959/drv8432-1959978.pdf?src-supplier=Digi-Key; ComponentLink5Description: https://datasheet.ciiva.com/1959/drv8432-1959978.pdf?src-supplier=Digi-Key; ComponentLink6URL: https://datasheet.ciiva.com/41457/001013555-da-01-en-ic-bridge-driver-drv8432dkdr-ssop-36-tid-41457289.pdf?src-supplier=Conrad; ComponentLink6Description: https://datasheet.ciiva.com/41457/001013555-da-01-en-ic-bridge-driver-drv8432dkdr-ssop-36-tid-41457289.pdf?src-supplier=Conrad; ComponentLink7URL: https://datasheet.ciiva.com/3228/drv8432-3228999.pdf?src-supplier=Avnet; ComponentLink7Description: https://datasheet.ciiva.com/3228/drv8432-3228999.pdf?src-supplier=Avnet; ComponentLink8URL: https://datasheet.ciiva.com/1959/drv8432-1959979.pdf?src-supplier=Digi-Key; ComponentLink8Description: https://datasheet.ciiva.com/1959/drv8432-1959979.pdf?src-supplier=Digi-Key; ComponentLink9URL: https://datasheet.ciiva.com/1959/drv8432-1959980.pdf?src-supplier=Digi-Key; ComponentLink9Description: https://datasheet.ciiva.com/1959/drv8432-1959980.pdf?src-supplier=Digi-Key
U3 U6 = AD4008BCPZ-RL7: 16-Bit, 2 MSPS/1 MSPS/500 kSPS, / Precision, Pseudo Differential, SAR ADCs; Value: Value; Type: Type; RefDes: RefDes; Supplier 1: Arrow Electronics; Supplier Part Number 1: AD4008BCPZ-RL7
U4 U7 = INA240A1PW: TEXAS INSTRUMENTS - INA240A1PWR . - CURRENT SENSE AMPLIFIER, 400KHZ, TSSOP-8; SymbolCreator: Altium; CompType: IC; U/M: EA; Number of Circuits: 1; Slew Rate: 2V/µs; Input Bias Current: 90uA; Input Offset Voltage (Vos): 5uV; Operating Supply Current: 1.8mA; SymbolVersion: 2016-01-07; PartNumber: INA240A1PW; PackageReference: PW0008A; MountType: SMT; ComponentLink1Description: Datasheet Link; ComponentLink1URL: https://sps06.itg.ti.com/sites/KMS/crossdivteams/altium/docs/ComponentDatasheets/INA240 Prelim DS - 9-15-15.pdf; Publisher: Texas Instruments; LatestRevisionDate: 2016-03-14; Manufacturer: Texas Instruments; Alternate Manufacturer: Texas Instruments; Manufacturer Part Number: INA240A1PWR; Category: Amplifiers - Op Amps, Buffer, Instrumentation; Stock 1: 14825; Pricing 1: 1=2.78000, 10=2.50000, 50=2.37000, 100=1.95000, 1000=1.40000, 10000=1.34000 (USD); Mount: Surface Mount; Case/Package: TSSOP; Min Operating Temperature: -40°C; Max Operating Temperature: 125°C; Packaging: Tape and Reel; -3db Bandwidth: 400kHz; RoHS Compliant: Yes; Lead Free: Lead Free; ComponentLink2URL: http://www.ti.com/lit/ds/symlink/ina240.pdf?src-supplier=Farnell; ComponentLink2Description: http://www.ti.com/lit/ds/symlink/ina240.pdf?src-supplier=Farnell; ComponentLink3URL: http://www.ti.com/lit/ds/symlink/ina240.pdf?src-supplier=Digi-Key; ComponentLink3Description: http://www.ti.com/lit/ds/symlink/ina240.pdf?src-supplier=Digi-Key; ComponentLink4URL: http://www.ti.com/lit/ds/symlink/ina240.pdf?src-supplier=Newark; ComponentLink4Description: http://www.ti.com/lit/ds/symlink/ina240.pdf?src-supplier=Newark; Supplier 1: Digi-Key; Supplier 2: Mouser; Supplier Part Number 2: 595-INA240A1PWR
U5 U8 = CMP-04895-000409-1: IC CURR SENSE 1 CIRCUIT 8SOIC; Input Offset Voltage (Vos): 5uV; Number of Circuits: 1; Slew Rate: 2V/µs; Input Bias Current: 90uA; -3db Bandwidth: 400kHz; Operating Supply Current: 1.8mA; Packaging: Rail/Tube; Min Operating Temperature: -40°C; Max Operating Temperature: 125°C; RoHS Compliant: Yes; Case/Package: SOIC; Mount: Surface Mount

## Nets that join several sheets
GND: top (21 pins), adc (7 pins), power_supply (68 pins), lvds_transceiver (10 pins), relay (18 pins), Ch1 (73 pins), Ch2 (73 pins), Ch3 (73 pins), Ch4 (73 pins), Ch5 (73 pins)
VDD: top (9 pins), adc (C1.1 U1.10), lvds_transceiver (C45.2 C46.2 U9.1 U10.1), relay (D6.2 K1.1), Ch1 (C19_Ch1.1 C36_Ch1.1 U3_Ch1.10 U6_Ch1.10), Ch2 (C19_Ch2.1 C36_Ch2.1 U3_Ch2.10 U6_Ch2.10), Ch3 (C19_Ch3.1 C36_Ch3.1 U3_Ch3.10 U6_Ch3.10), Ch4 (C19_Ch4.1 C36_Ch4.1 U3_Ch4.10 U6_Ch4.10), Ch5 (C19_Ch5.1 C36_Ch5.1 U3_Ch5.10 U6_Ch5.10)
VDD1.8: adc (C2.1 U1.2), power_supply (C56.2 TP5.1 U11.5), Ch1 (C20_Ch1.1 C37_Ch1.1 U3_Ch1.2 U6_Ch1.2), Ch2 (C20_Ch2.1 C37_Ch2.1 U3_Ch2.2 U6_Ch2.2), Ch3 (C20_Ch3.1 C37_Ch3.1 U3_Ch3.2 U6_Ch3.2), Ch4 (C20_Ch4.1 C37_Ch4.1 U3_Ch4.2 U6_Ch4.2), Ch5 (C20_Ch5.1 C37_Ch5.1 U3_Ch5.2 U6_Ch5.2)
VDD5: top (FPGA1.41 FPGA1.42), power_supply (FB1.1)
VDD6: top (J4.25), power_supply (17 pins)
VDD12: top (P3.2 P6.2), power_supply (8 pins), relay (P1.2 P2.5 P2.10 R33.2), Ch1 (10 pins), Ch2 (10 pins), Ch3 (10 pins), Ch4 (10 pins), Ch5 (10 pins)
VDDA: power_supply (13 pins), Ch1 (8 pins), Ch2 (8 pins), Ch3 (8 pins), Ch4 (8 pins), Ch5 (8 pins)
VM: top (J4.16), power_supply (18 pins), Ch1 (10 pins), Ch2 (10 pins), Ch3 (10 pins), Ch4 (10 pins), Ch5 (10 pins)
VREF: adc (C4.1 U1.1), power_supply (C59.2 TP4.1 U13.6), Ch1 (12 pins), Ch2 (12 pins), Ch3 (12 pins), Ch4 (12 pins), Ch5 (12 pins)
/BRAKE1: top (J4.20), Ch1 (R4_Ch1.2 U7_Ch1.3 U8_Ch1.1)
/BRAKE2: top (J4.22), Ch1 (C10_Ch1.2 C14_Ch1.1 L2_Ch1.2)
/BRAKE3: top (J4.24), Ch2 (R4_Ch2.2 U7_Ch2.3 U8_Ch2.1)
/MOTOR1: top (J4.2), Ch2 (C10_Ch2.2 C14_Ch2.1 L2_Ch2.2)
/MOTOR2: top (J4.4), Ch3 (C10_Ch3.2 C14_Ch3.1 L2_Ch3.2)
/MOTOR3: top (J4.6), Ch4 (C10_Ch4.2 C14_Ch4.1 L2_Ch4.2)
/MOTOR4: top (J4.8), Ch5 (C10_Ch5.2 C14_Ch5.1 L2_Ch5.2)
/MOTOR5: top (J4.11), Ch3 (R4_Ch3.2 U7_Ch3.3 U8_Ch3.1)
/MOTOR6: top (J4.13), Ch4 (R4_Ch4.2 U7_Ch4.3 U8_Ch4.1)
/MOTOR7: top (J4.15), Ch5 (R4_Ch5.2 U7_Ch5.3 U8_Ch5.1)
/RELAY: top (FPGA1.30), relay (K1.4)
ADC_CNV: top (FPGA1.55 R39.1 R42.2), adc (U1.6), Ch1 (U3_Ch1.6 U6_Ch1.6), Ch2 (U3_Ch2.6 U6_Ch2.6), Ch3 (U3_Ch3.6 U6_Ch3.6), Ch4 (U3_Ch4.6 U6_Ch4.6), Ch5 (U3_Ch5.6 U6_Ch5.6)
ADC_CUR_SDO1_1: top (FPGA1.85), Ch1 (R21_Ch1.1)
ADC_CUR_SDO1_2: top (FPGA1.68), Ch2 (R21_Ch2.1)
ADC_CUR_SDO1_3: top (FPGA1.48), Ch3 (R21_Ch3.1)
ADC_CUR_SDO1_4: top (FPGA1.19), Ch4 (R21_Ch4.1)
ADC_CUR_SDO1_5: top (FPGA1.35), Ch5 (R21_Ch5.1)
ADC_CUR_SDO2_1: top (FPGA1.65), Ch1 (R23_Ch1.1)
ADC_CUR_SDO2_2: top (FPGA1.86), Ch2 (R23_Ch2.1)
ADC_CUR_SDO2_3: top (FPGA1.66), Ch3 (R23_Ch3.1)
ADC_CUR_SDO2_4: top (FPGA1.9), Ch4 (R23_Ch4.1)
ADC_CUR_SDO2_5: top (FPGA1.20), Ch5 (R23_Ch5.1)
ADC_IN: adc (R1.1), power_supply (R24.1 R25.2)
ADC_MV_SDO: top (FPGA1.57), adc (R2.1)
ADC_SCK: top (FPGA1.61 R40.1 R43.2), adc (U1.8), Ch1 (U3_Ch1.8 U6_Ch1.8), Ch2 (U3_Ch2.8 U6_Ch2.8), Ch3 (U3_Ch3.8 U6_Ch3.8), Ch4 (U3_Ch4.8 U6_Ch4.8), Ch5 (U3_Ch5.8 U6_Ch5.8)
ADC_SDI: top (FPGA1.63 R41.1 R44.2), adc (U1.9), Ch1 (U3_Ch1.9 U6_Ch1.9), Ch2 (U3_Ch2.9 U6_Ch2.9), Ch3 (U3_Ch3.9 U6_Ch3.9), Ch4 (U3_Ch4.9 U6_Ch4.9), Ch5 (U3_Ch5.9 U6_Ch5.9)
BRAKE1: top (J4.19), Ch1 (C11_Ch1.2 C15_Ch1.1 L3_Ch1.2)
BRAKE2: top (J4.21), Ch1 (R3_Ch1.2 R18_Ch1.2 U4_Ch1.2 U5_Ch1.8)
BRAKE3: top (J4.23), Ch2 (C11_Ch2.2 C15_Ch2.1 L3_Ch2.2)
COIL1_N2: top (J4.1), Ch2 (R3_Ch2.2 R18_Ch2.2 U4_Ch2.2 U5_Ch2.8)
COIL1_N3: top (J4.3), Ch3 (R3_Ch3.2 R18_Ch3.2 U4_Ch3.2 U5_Ch3.8)
COIL1_N4: top (J4.5), Ch4 (R3_Ch4.2 R18_Ch4.2 U4_Ch4.2 U5_Ch4.8)
COIL1_N5: top (J4.7), Ch5 (R3_Ch5.2 R18_Ch5.2 U4_Ch5.2 U5_Ch5.8)
COIL2_N3: top (J4.10), Ch3 (C11_Ch3.2 C15_Ch3.1 L3_Ch3.2)
COIL2_N4: top (J4.12), Ch4 (C11_Ch4.2 C15_Ch4.1 L3_Ch4.2)
COIL2_N5: top (J4.14), Ch5 (C11_Ch5.2 C15_Ch5.1 L3_Ch5.2)
dSIB_INT: top (FPGA1.88), lvds_transceiver (D9.1 J1.8 P5.4)
dSIB_RX: top (FPGA1.43), lvds_transceiver (D10.1 J1.7 P5.3)
dSIB_TX: top (FPGA1.46), lvds_transceiver (D11.1 J1.6 P5.2)
ESPM_POWER_EN: top (FPGA1.32), power_supply (U12.B3 U14.5)
ESPM_POWER_GOOD: top (FPGA1.34), power_supply (U12.B1)
LVDS_RCLK: top (FPGA1.52), lvds_transceiver (U9.2)
LVDS_RDAT: top (FPGA1.53), lvds_transceiver (U9.3)
LVDS_TCLK: top (FPGA1.47), lvds_transceiver (U10.2)
LVDS_TDAT: top (FPGA1.49), lvds_transceiver (U10.3)
MOTOR_POWER_EN: top (FPGA1.24), relay (Q1.5 Q2.5 R30.2 R31.2)
NetJ2_1: power_supply (J2.1), relay (Q1.6)
nFAULT1: top (FPGA1.81), Ch1 (U2_Ch1.3)
nFAULT2: top (FPGA1.72), Ch2 (U2_Ch2.3)
nFAULT3: top (FPGA1.51), Ch3 (U2_Ch3.3)
nFAULT4: top (FPGA1.17), Ch4 (U2_Ch4.3)
nFAULT5: top (FPGA1.31), Ch5 (U2_Ch5.3)
nOTW1: top (FPGA1.83), Ch1 (U2_Ch1.2)
nOTW2: top (FPGA1.70), Ch2 (U2_Ch2.2)
nOTW3: top (FPGA1.50), Ch3 (U2_Ch3.2)
nOTW4: top (FPGA1.18), Ch4 (U2_Ch4.2)
nOTW5: top (FPGA1.33), Ch5 (U2_Ch5.2)
nRESET1_1: top (FPGA1.77), Ch1 (R6_Ch1.2 R8_Ch1.2 U2_Ch1.5)
nRESET1_2: top (FPGA1.76), Ch2 (R6_Ch2.2 R8_Ch2.2 U2_Ch2.5)
nRESET1_3: top (FPGA1.56), Ch3 (R6_Ch3.2 R8_Ch3.2 U2_Ch3.5)
nRESET1_4: top (FPGA1.15), Ch4 (R6_Ch4.2 R8_Ch4.2 U2_Ch4.5)
nRESET1_5: top (FPGA1.27), Ch5 (R6_Ch5.2 R8_Ch5.2 U2_Ch5.5)
nRESET2_1: top (FPGA1.69), Ch1 (R7_Ch1.2 R9_Ch1.2 U2_Ch1.15)
nRESET2_2: top (FPGA1.82), Ch2 (R7_Ch2.2 R9_Ch2.2 U2_Ch2.15)
nRESET2_3: top (FPGA1.62), Ch3 (R7_Ch3.2 R9_Ch3.2 U2_Ch3.15)
nRESET2_4: top (FPGA1.11), Ch4 (R7_Ch4.2 R9_Ch4.2 U2_Ch4.15)
nRESET2_5: top (FPGA1.22), Ch5 (R7_Ch5.2 R9_Ch5.2 U2_Ch5.15)
PWM1_N1: top (FPGA1.79), Ch1 (U2_Ch1.4)
PWM1_N2: top (FPGA1.74), Ch2 (U2_Ch2.4)
PWM1_N3: top (FPGA1.54), Ch3 (U2_Ch3.4)
PWM1_N4: top (FPGA1.16), Ch4 (U2_Ch4.4)
PWM1_N5: top (FPGA1.29), Ch5 (U2_Ch5.4)
PWM1_P1: top (FPGA1.75), Ch1 (U2_Ch1.6)
PWM1_P2: top (FPGA1.78), Ch2 (U2_Ch2.6)
PWM1_P3: top (FPGA1.58), Ch3 (U2_Ch3.6)
PWM1_P4: top (FPGA1.13), Ch4 (U2_Ch4.6)
PWM1_P5: top (FPGA1.25), Ch5 (U2_Ch5.6)
PWM2_N1: top (FPGA1.71), Ch1 (U2_Ch1.14)
PWM2_N2: top (FPGA1.80), Ch2 (U2_Ch2.14)
PWM2_N3: top (FPGA1.60), Ch3 (U2_Ch3.14)
PWM2_N4: top (FPGA1.12), Ch4 (U2_Ch4.14)
PWM2_N5: top (FPGA1.23), Ch5 (U2_Ch5.14)
PWM2_P1: top (FPGA1.67), Ch1 (U2_Ch1.16)
PWM2_P2: top (FPGA1.84), Ch2 (U2_Ch2.16)
PWM2_P3: top (FPGA1.64), Ch3 (U2_Ch3.16)
PWM2_P4: top (FPGA1.10), Ch4 (U2_Ch4.16)
PWM2_P5: top (FPGA1.21), Ch5 (U2_Ch5.16)
RELAY-ON: top (FPGA1.36), relay (Q3.2 R38.2)
SAFETY_CHAIN_EN_SENSE: top (FPGA1.28), relay (Q1.2 Q2.2 R32.1 R34.2)
SAFETY_CHAIN_S_SENSE: top (FPGA1.1 P6.4), relay (Q4.3 R45.2)

## Assembly variants
main: not fitted C13_Ch1 C13_Ch2 C13_Ch3 C13_Ch4 C13_Ch5 C14_Ch1 C14_Ch2 C14_Ch3 C14_Ch4 C14_Ch5 C15_Ch1 C15_Ch2 C15_Ch3 C15_Ch4 C15_Ch5 C16_Ch1 C16_Ch2 C16_Ch3 C16_Ch4 C16_Ch5 C60 C61 C72 C73 C74 C75 C76 C77 C78 D9 D10 D11 D12 L9 P5 Q4 R10_Ch1 R10_Ch2 R10_Ch3 R10_Ch4 R10_Ch5 R11_Ch1 R11_Ch2 R11_Ch3 R11_Ch4 R11_Ch5 R12_Ch1 R12_Ch2 R12_Ch3 R12_Ch4 R12_Ch5 R13_Ch1 R13_Ch2 R13_Ch3 R13_Ch4 R13_Ch5 R14_Ch1 R14_Ch2 R14_Ch3 R14_Ch4 R14_Ch5 R15_Ch1 R15_Ch2 R15_Ch3 R15_Ch4 R15_Ch5 R16_Ch1 R16_Ch2 R16_Ch3 R16_Ch4 R16_Ch5 R17_Ch1 R17_Ch2 R17_Ch3 R17_Ch4 R17_Ch5 R28 R29 R45 R46 R47 U5_Ch1 U5_Ch2 U5_Ch3 U5_Ch4 U5_Ch5 U8_Ch1 U8_Ch2 U8_Ch3 U8_Ch4 U8_Ch5 U14